# Altium schematic sheet Instrumentation.SchDoc
size A
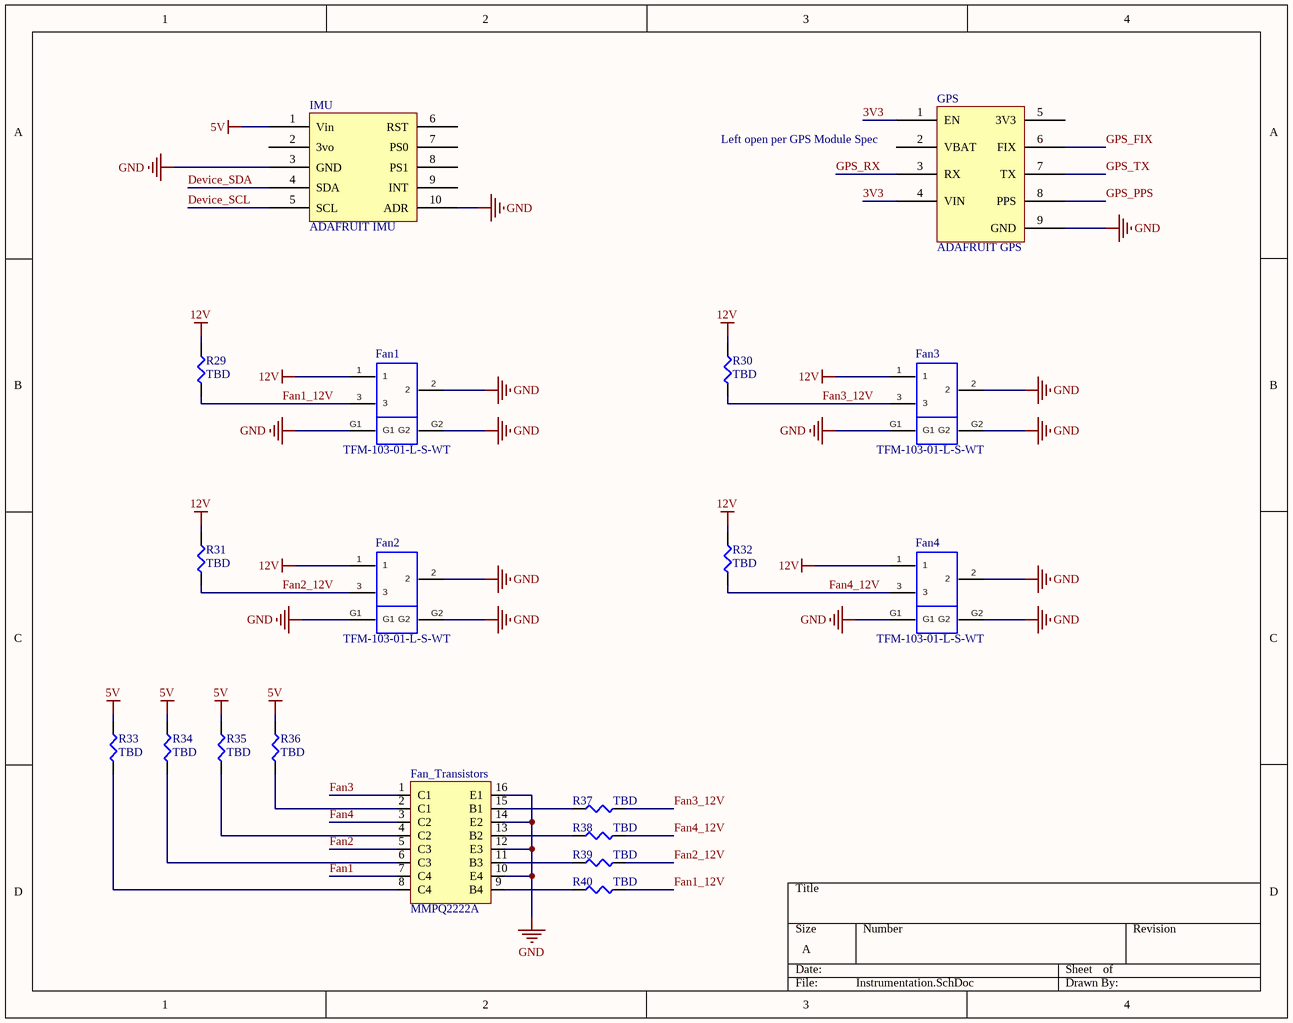
[diagram p0: Instrumentation.SchDoc]

## Parts
Fan1  TFM-103-01-L-S-WT  [TFM-103-01-L-S-WT]
Fan2  TFM-103-01-L-S-WT  [TFM-103-01-L-S-WT]
Fan3  TFM-103-01-L-S-WT  [TFM-103-01-L-S-WT]
Fan4  TFM-103-01-L-S-WT  [TFM-103-01-L-S-WT]
Fan_Transistors  MMPQ2222A  [MMPQ2222A]
GPS  ADAFRUIT GPS  [ADAFRUIT ULTIMATE GPS]
IMU  ADAFRUIT IMU  [ADAFRUIT IMU]
R29  TBD  [0805R-GENERIC]
R30  TBD  [0805R-GENERIC]
R31  TBD  [0805R-GENERIC]
R32  TBD  [0805R-GENERIC]
R33  TBD  [0805R-GENERIC]
R34  TBD  [0805R-GENERIC]
R35  TBD  [0805R-GENERIC]
R36  TBD  [0805R-GENERIC]
R37  TBD  [0805R-GENERIC]
R38  TBD  [0805R-GENERIC]
R39  TBD  [0805R-GENERIC]
R40  TBD  [0805R-GENERIC]

## Nets
5V: IMU.1(Vin) R33.1 R34.1 R35.1 R36.1
12V: Fan1.1 Fan2.1 Fan3.1 Fan4.1 R29.1 R30.1 R31.1 R32.1
GND: Fan1.2 Fan1.G1 Fan1.G2 Fan2.2 Fan2.G1 Fan2.G2 Fan3.2 Fan3.G1 Fan3.G2 Fan4.2 Fan4.G1 Fan4.G2 Fan_Transistors.10(E4) Fan_Transistors.12(E3) Fan_Transistors.14(E2) Fan_Transistors.16(E1) GPS.9(GND) IMU.3(GND) IMU.10(ADR)
3V3: GPS.1(EN) GPS.4(VIN)
Device_SCL: IMU.5(SCL)
Device_SDA: IMU.4(SDA)
Fan1: Fan_Transistors.7(C4)
Fan1_12V: Fan1.3 R29.2 R40.2
Fan2: Fan_Transistors.5(C3)
Fan2_12V: Fan2.3 R31.2 R39.2
Fan3: Fan_Transistors.1(C1)
Fan3_12V: Fan3.3 R30.2 R37.2
Fan4: Fan_Transistors.3(C2)
Fan4_12V: Fan4.3 R32.2 R38.2
GPS_FIX: GPS.6(FIX)
GPS_PPS: GPS.8(PPS)
GPS_RX: GPS.3(RX)
GPS_TX: GPS.7(TX)
NetFan_Transistors_2: Fan_Transistors.2(C1) R36.2
NetFan_Transistors_4: Fan_Transistors.4(C2) R35.2
NetFan_Transistors_6: Fan_Transistors.6(C3) R34.2
NetFan_Transistors_8: Fan_Transistors.8(C4) R33.2
NetFan_Transistors_9: Fan_Transistors.9(B4) R40.1
NetFan_Transistors_11: Fan_Transistors.11(B3) R39.1
NetFan_Transistors_13: Fan_Transistors.13(B2) R38.1
NetFan_Transistors_15: Fan_Transistors.15(B1) R37.1

Not connected (* = marked no-connect by the designer): GPS 2(VBAT) 5(3V3); IMU 2(3vo) 6(RST) 7(PS0) 8(PS1) 9(INT)

## Notes on the sheet
- (near GPS) Left open per GPS Module Spec

## Library data of the parts
R29-R40 = 0805R-TBD: RESISTOR 0805 VALUE TO BE DETERMINED
Fan_Transistors = MMPQ2222A: Supplier 1: Arrow; Supplier Part Number 1: MMPQ2222A
GPS = ADAFRUIT GPS: Supplier 1: Digi-Key; Supplier Part Number 1: 1528-1153-ND
IMU = ADAFRUIT IMU: Supplier 1: Arrow; Supplier Part Number 1: 2472